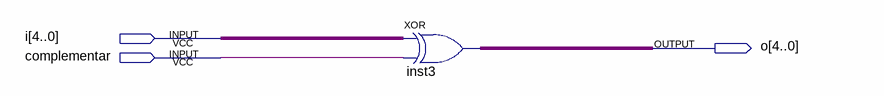
[diagram p0: schematic sheet]
// Quartus schematic Complemento.bdf as structural Verilog: 1 symbols, 3 pins
module Complemento (
  input  [4:0] i,
  input  complementar,
  output [4:0] o
);

  assign o = i ^ {5{complementar}};  // XOR inst3, 5 bits wide
endmodule
